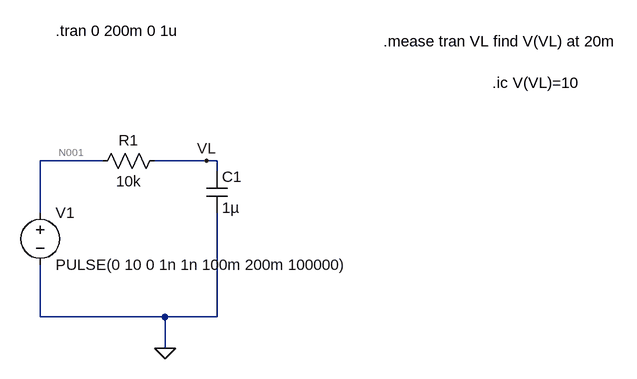
[diagram p0: schematic Question 4.asc]
Question 4.asc, the LTspice schematic file:
Version 4
SHEET 1 964 680
WIRE 144 240 48 240
WIRE 304 240 224 240
WIRE 320 240 304 240
WIRE 320 256 320 240
WIRE 48 320 48 240
WIRE 48 480 48 400
WIRE 240 480 48 480
WIRE 320 480 320 320
WIRE 320 480 240 480
WIRE 240 528 240 480
FLAG 240 528 0
FLAG 304 240 VL
SYMBOL voltage 48 304 R0
WINDOW 123 0 0 Left 0
WINDOW 39 0 0 Left 0
SYMATTR InstName V1
SYMATTR Value PULSE(0 10 0 1n 1n 100m 200m 100000)
SYMBOL res 240 224 R90
WINDOW 0 0 56 VBottom 2
WINDOW 3 32 56 VTop 2
SYMATTR InstName R1
SYMATTR Value 10k
SYMBOL cap 304 256 R0
SYMATTR InstName C1
SYMATTR Value 1µ
TEXT 72 40 Left 2 !.tran 0 200m 0 1u
TEXT 576 56 Left 2 !.mease tran VL find V(VL) at 20m
TEXT 744 120 Left 2 !.ic V(VL)=10

The netlist it stands for:
* Question 4.asc
V1 N001 0 PULSE(0 10 0 1n 1n 100m 200m 100000)
R1 VL N001 10k
C1 VL 0 1µ
.tran 0 200m 0 1u
.mease tran VL find V(VL) at 20m
.ic V(VL)=10
.backanno
.end

* Results of the author's LTspice run, read from the files saved beside the schematic
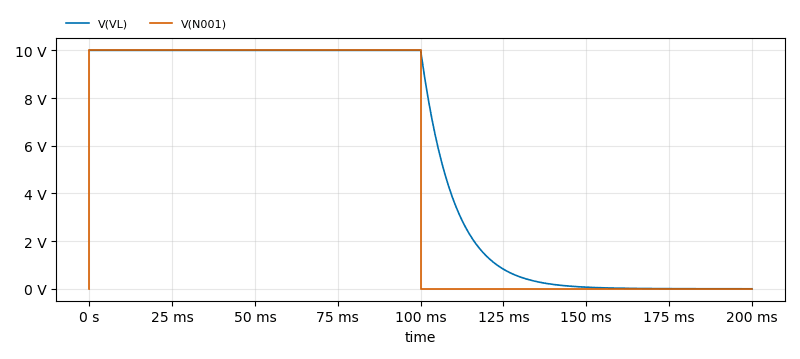
[diagram p1: Transient Analysis of Question 4.asc, plotted from the saved traces]
* Transient Analysis, 1 run:
*   V(VL): min 454 µV, max 10 V, average 5.5 V, rms 7.246 V, last 454 µV
*   V(N001): min 0 V, max 10 V, average 5 V, rms 7.071 V, last 0 V